# Altium schematic sheet Sheet1.SchDoc
size A4
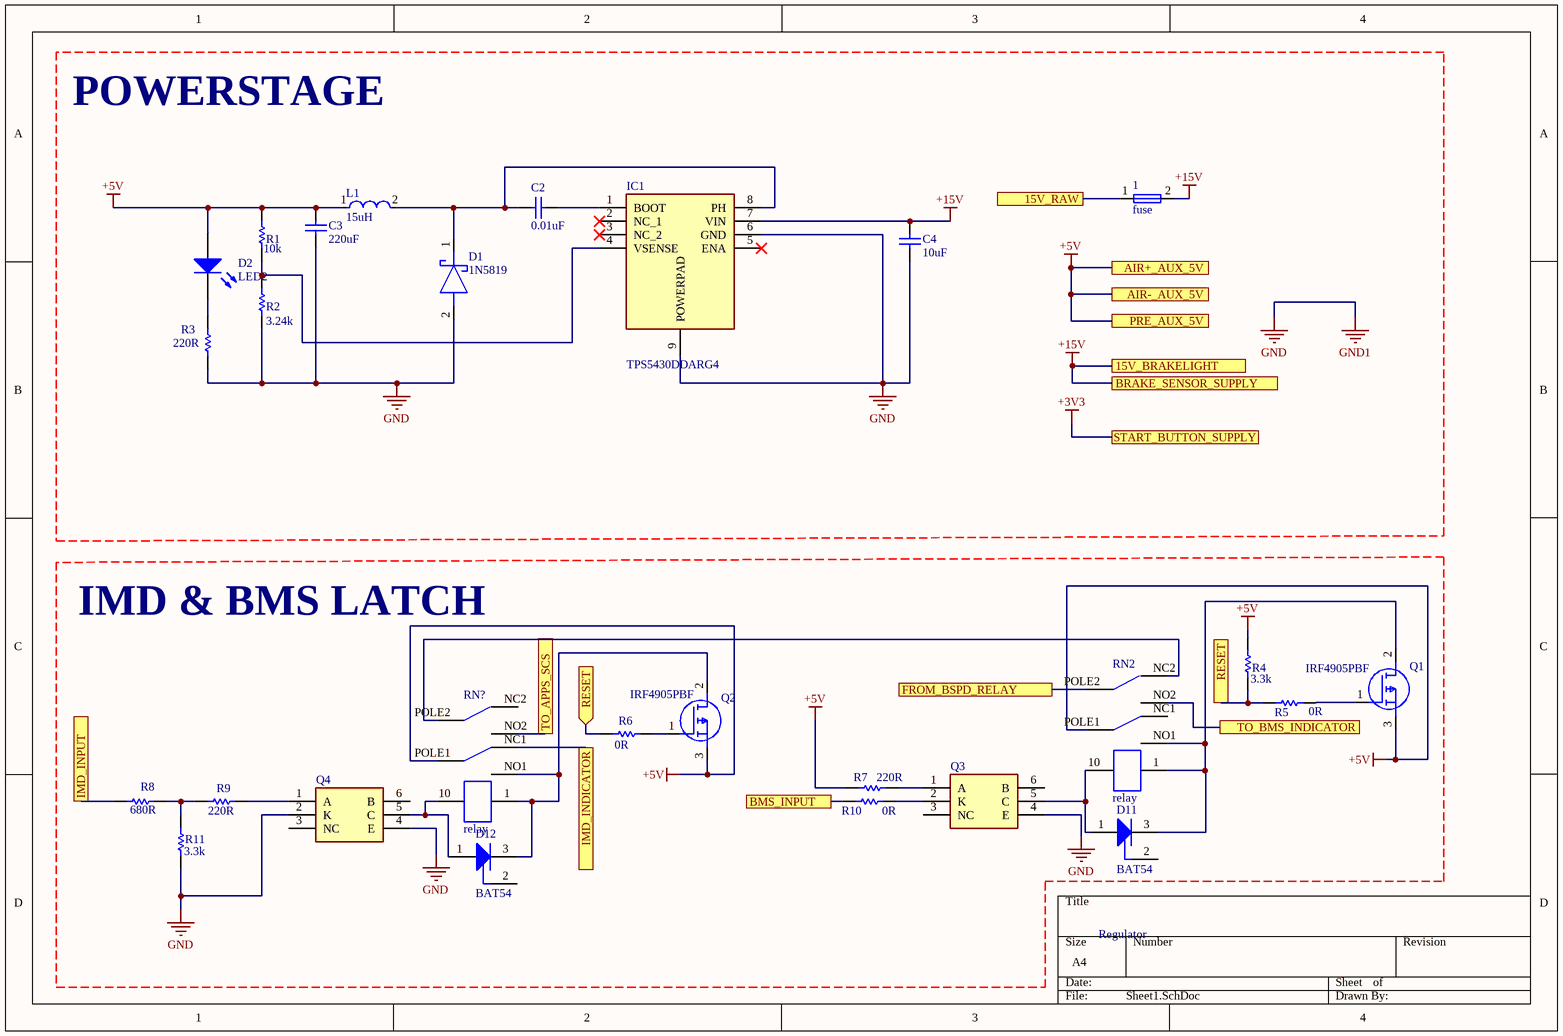
[diagram p0: Sheet1.SchDoc]

## Parts
1  fuse  [fuse]
C2  0.01uF  [KEMT-1206-2_N]
C3  220uF  [KEMT-1206-2_N]
C4  10uF  [KEMT-1206-2_N]
D1  1N5819  [DIOAD1796W86L628D292]
D2  LED2  [3.2X1.6X1.1]
D11  BAT54  [INF-SOT23_N]
D12  BAT54  [INF-SOT23_N]
IC1  TPS5430DDARG4  [SOIC127P600X175-8N]
L1  15uH  [FP-IR02-MFG]
Q1  IRF4905PBF  [TO254P469X1042X1967-3P]
Q2  IRF4905PBF  [TO254P469X1042X1967-3P]
Q3  MCT2ESM  [SOT254P916X480-6N]  (value not drawn)
Q4  MCT2ESM  [SOT254P916X480-6N]  (value not drawn)
R1  10k  [RESC3216X60X45NL10T20 - duplicate]
R2  3.24k  [RESC3216X60X45NL10T20 - duplicate]
R3  220R  [RESC3216X60X45NL10T20 - duplicate]
R4  3.3k  [RESC3216X60X45NL10T20 - duplicate]
R5  0R  [RESC3216X60X45NL10T20 - duplicate]
R6  0R  [RESC3216X60X45NL10T20 - duplicate]
R7  220R  [RESC3216X60X45NL10T20 - duplicate]
R8  680R  [RESC3216X60X45NL10T20 - duplicate]
R9  220R  [RESC3216X60X45NL10T20 - duplicate]
R10  0R  [RESC3216X60X45NL10T20 - duplicate]
R11  3.3k  [RESC3216X60X45NL10T20 - duplicate]
RN2  relay  [relaytq]
RN?  relay  [relaytq]

## Blocks framed on the sheet
POWERSTAGE: 1 C2-C4 D1 D2 IC1 L1 R1-R3
IMD & BMS LATCH: D11 D12 Q1-Q4 R4-R11 RN2 RN?

## Ports
15V_BRAKELIGHT, 15V_RAW, AIR+_AUX_5V, AIR-_AUX_5V, BMS_INPUT, BRAKE_SENSOR_SUPPLY, FROM_BSPD_RELAY, IMD_INDICATOR, IMD_INPUT, PRE_AUX_5V, RESET, RESET (in), START_BUTTON_SUPPLY, TO_APPS_SCS, TO_BMS_INDICATOR

## Nets
+3V3: port START_BUTTON_SUPPLY
+5V: C3.1 D2.1(A) L1.1 Q1.3(S) Q2.3(S) R1.2 R4.2 R7.2 RN?.POLE1 ; port AIR+_AUX_5V, port AIR-_AUX_5V, port PRE_AUX_5V
+15V: 1.2 C4.1 IC1.7(VIN) ; port BRAKE_SENSOR_SUPPLY, port 15V_BRAKELIGHT
GND: C3.2 C4.2 D1.2(A) IC1.6(GND) IC1.9(POWERPAD) Q3.4(E) Q4.2(K) Q4.4(E) R2.1 R3.1 R11.1  [also labelled GND1]
15V_RAW: 1.1 ; port 15V_RAW
BMS_INPUT: R10.2 ; port BMS_INPUT
FROM_BSPD_RELAY: RN2.POLE2 ; port FROM_BSPD_RELAY
IMD_INDICATOR: RN?.NC1 ; port IMD_INDICATOR
IMD_INPUT: R8.2 ; port IMD_INPUT
RESET: R4.1 R5.2 R6.2 ; port RESET
TO_APPS_SCS: RN?.NO2 ; port TO_APPS_SCS
TO_BMS_INDICATOR: RN2.NO2 ; port TO_BMS_INDICATOR
NetC2_1: C2.1 D1.1(K) IC1.8(PH) L1.2
NetC2_2: C2.2 IC1.1(BOOT)
NetD2_2: D2.2(K) R3.2
NetD11_1: D11.1(A) Q3.5(C) RN2.10
NetD11_3: D11.3(K) Q1.2(D) RN2.1 RN2.NO1
NetD12_1: D12.1(A) Q4.5(C) RN?.10
NetD12_3: D12.3(K) Q2.2(D) RN?.1 RN?.NO1
NetIC1_4: IC1.4(VSENSE) R1.1 R2.2
NetQ1_1: Q1.1(G) R5.1
NetQ2_1: Q2.1(G) R6.1
NetQ3_1: Q3.1(A) R7.1
NetQ3_2: Q3.2(K) R10.1
NetQ4_1: Q4.1(A) R9.1
NetR8_1: R8.1 R9.2 R11.2
NetRN2_NC2: RN2.NC2 RN?.POLE2

Not connected (* = marked no-connect by the designer): D11 2(NC); D12 2(NC); IC1 2(NC_1)* 3(NC_2)* 5(ENA)*; Q3 3(NC) 6(B); Q4 3(NC) 6(B); RN2 NC1 POLE1; RN? NC2

## Notes on the sheet
- Regulator

## Library data of the parts
C2-C4 = CMP-1037-04202-2: CAP, Ceramic, 0.1 uF, +/- 10%, 50 V, -55 to 125 degC, 1206 (3216 Metric), RoHS, Tape and Reel; Manufacturer: Kemet; Voltage Rating: 50V; Capacitance: 0.1µF; Product Range: KEMET-CSeries; SVHC: ToBeAdvised; Dielectric Characteristic: X7R; Capacitor Case Style: 1206[3216Metric]; Package Reference: 1206-2; Package Description: 2-Leads SMD, Body 3.2 x 1.6 mm; Packaging: Tape&Reel; Operating Temperature Max: 125degC; Capacitance Tolerance: ±10%; Datasheet URL: https://datasheet.ciiva.com/6125/1725438-6125494.pdf; Manufacturer URL: http://www.kemet.com/; Operating Temperature Min: -55degC; Datasheet Version: Jul-13
D1 = 1N5819: Schottky Diode; Manufacturer_Name: NEUTRAL; Datasheet Link: http://uk.rs-online.com/web/p/products/1124416; Manufacturer_Part_Number: 1N5819
D2 = LED2: Typical RED, GREEN, YELLOW, AMBER GaAs LED; Published: 8-Jun-2000; LatestRevisionDate: 17-Jul-2002; LatestRevisionNote: Re-released for DXP Platform.; PackageVersion: Feb-2002; PackageReference: 3.2X1.6X1.1; Publisher: Altium Limited; PackageDescription: SM LED; 2 Flat Leads
D11 D12 = CMP-1182-00010-1: Silicon Schottky Diode, SOT23, Reel, Green; Manufacturer: Infineon; VF (max): 800Â mV; Configuration: Single; IF (max): 200Â mA; CT (max): 10Â pF; Green: TRUE; VR (max): 30Â V; PartNumber: BAT54; ComponentLink2URL: http://www.infineon.com/dgdl/bat54series.pdf?folderId=db3a30431400ef68011425f1ca2505e3&fileId=db3a304314dca3890115190b74210ea6; ComponentLink3Description: Package Specification; PackageVersion: Apr-08; PackageDescription: 3-Pin Small Outline Transistor Package, 1.3 x 2.9 mm Body, 0.95 mm Pitch; ComponentLink1Description: Manufacturer URL; ComponentLink1URL: http://www.infineon.com/; Mounting Technology: Surface Mount; Packing: Reel; ComponentLink2Description: Datasheet; PackageReference: SOT23; ComponentLink3URL: http://www.infineon.com/dgdl/SOT23-Package_Overview.pdf?folderId=db3a30431936bc4b0119532290053c66&fileId=db3a30431936bc4b0119533468123c85
IC1 = TPS5430DDARG4: Integrated Circuit; Manufacturer_Name: Texas Instruments; Datasheet Link: http://www.ti.com/general/docs/suppproductinfo.tsp?distId=10&gotoUrl=http%3A%2F%2Fwww.ti.com%2Flit%2Fgpn%2Ftps5431; Height: 1.7mm; Manufacturer_Part_Number: TPS5430DDARG4; Mouser Part Number: 595-TPS5430DDARG4; Mouser Price/Stock: https://www.mouser.co.uk/ProductDetail/Texas-Instruments/TPS5430DDARG4?qs=zwk82MlA57YG4K%2FfUMTveg%3D%3D
L1 = CMP-03630-000001-1: IR-2 10 10% B08; Obsolete Part: true; Manufacturer: Vishay Dale; Manufacturer Part Number: IR02BH100K; Core Material: Iron; Value: 10uH; Test Frequency: 7.9MHz; Saturation Current: 130mA; Series Resistance: 3.7Ω; Q Factor: 55; Self Resonant Frequency: 50MHz; Device Class L2: Inductors; ComponentLink2Description: Datasheet; Temperature Range Low: -55°C; Digikey Description: IR-2 10 10% B08; Temperature Range High: +105°C; Inductance: 10uH; Height: 3.05mm; Package: IR02; Tolerance: 10%; Device Class L1: Passive Components; Category: Ind; Device Class L3: Fixed Inductors; RoHS: TRUE; Octopart: https://octopart.com/ir02bh100k-vishay+dale-39675774; Temperature: -55°C to +105°C; Ipc Land Pattern Name: CAPAD1147W70L838D305; Lead Free: Yes; ComponentLink2URL: https://datasheet.ciiva.com/8536/ir-8536517.pdf; Automotive: No; Mouser Description: Fixed Inductors 10uH 10%
Q1 Q2 = IRF4905PBF: MOSFET (P-Channel); Manufacturer_Name: Infineon; Datasheet Link: http://docs-emea.rs-online.com/webdocs/0791/0900766b807910f2.pdf; Height: 4.69mm; Manufacturer_Part_Number: IRF4905PBF; Mouser Part Number: 942-IRF4905PBF; Mouser Price/Stock: https://www.mouser.co.uk/ProductDetail/Infineon-IR/IRF4905PBF/?qs=9%252BKlkBgLFf39l0HsWdxvdw%3D%3D; Arrow Part Number: IRF4905PBF; Arrow Price/Stock: https://www.arrow.com/en/products/irf4905pbf/infineon-technologies-ag
Q3 Q4 = MCT2ESM: Phototransistor; Manufacturer_Name: ON Semiconductor; Datasheet Link: https://www.onsemi.com/pub/Collateral/MCT2EM-D.PDF; Height: 4.8mm; Manufacturer_Part_Number: MCT2ESM; Mouser Part Number: 512-MCT2ESM; Mouser Price/Stock: https://www.mouser.co.uk/ProductDetail/ON-Semiconductor-Fairchild/MCT2ESM/?qs=nW0pe8qlIZjLnc6UyUzYTw%3D%3D; Arrow Part Number: MCT2ESM; Arrow Price/Stock: https://www.arrow.com/en/products/mct2esm/on-semiconductor
R1-R11 = CMP-2003-02213-1: Part Number: CRCW120647K0FKEA; Manufacturer: Vishay Dale